# EAGLE schematic DAC breakout (EAGLE 7.4.0)
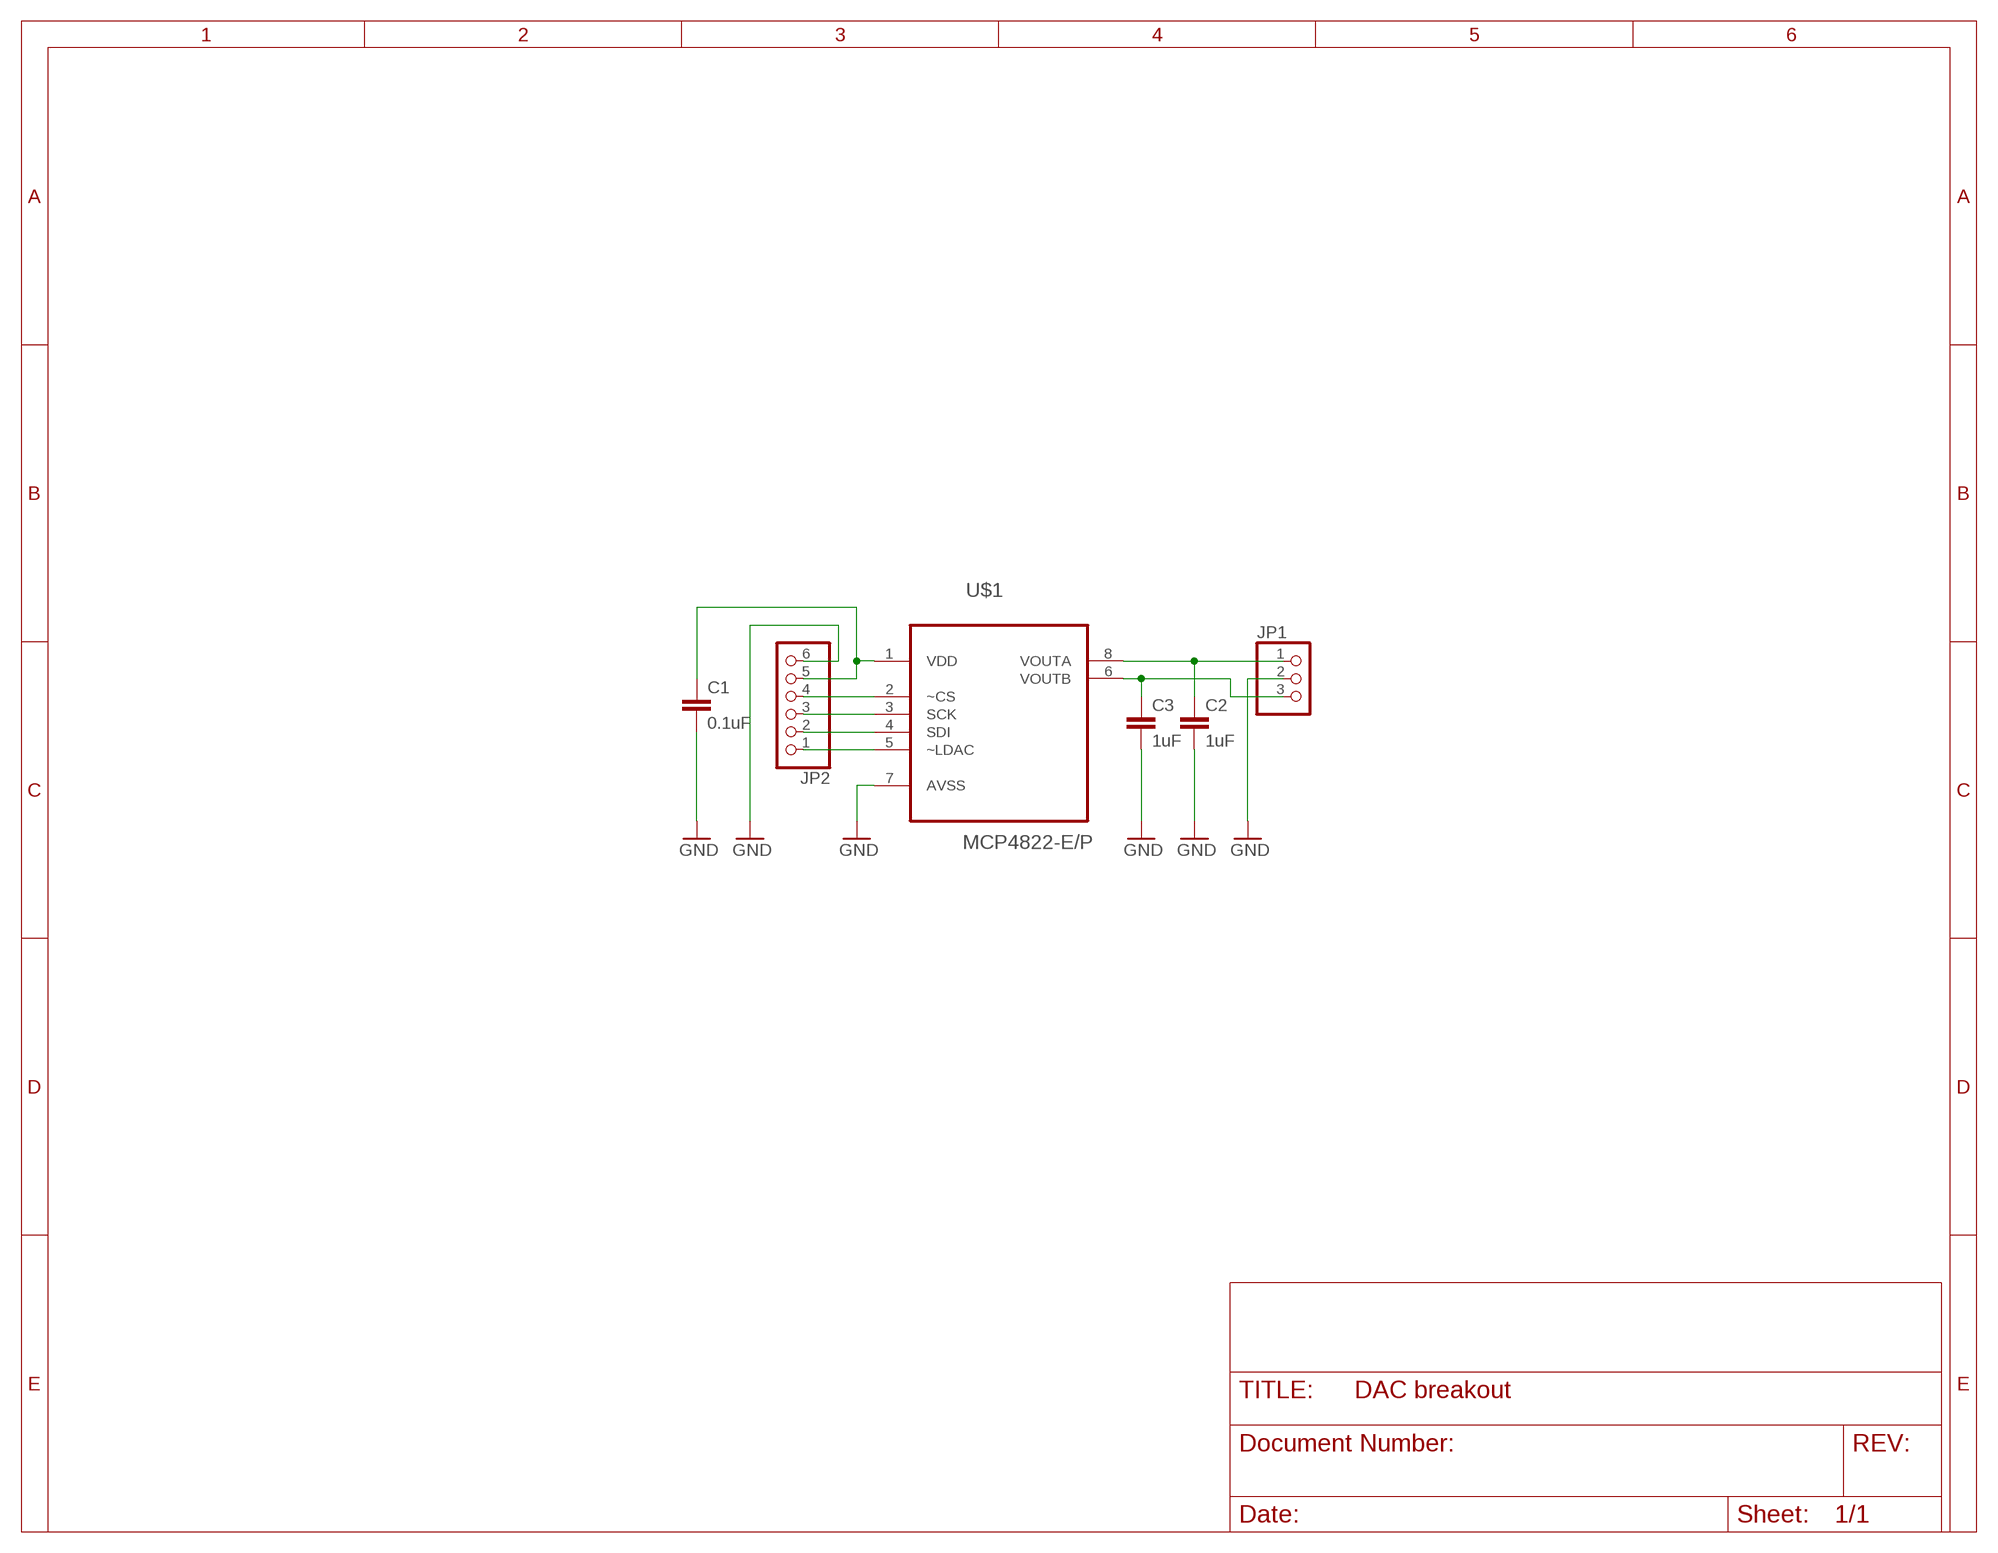
[diagram p0: schematic, sheet 1]

## Parts
C1  0.1uF  C-EU025-025X050  [C025-025X050]
C2  1uF  C-EU025-025X050  [C025-025X050]
C3  1uF  C-EU025-025X050  [C025-025X050]
JP1  PINHD-1X3  [1X03]
JP2  PINHD-1X6  [1X06]
U$1  MCP4822-E/P  [DIP254P762X432-8]

## Nets
GND: C1.2 C2.2 C3.2 JP1.2 JP2.6 U$1.7(AVSS)
N$1: C1.1 JP2.5 U$1.1(VDD)
N$2: C2.1 JP1.1 U$1.8(VOUTA)
N$3: C3.1 JP1.3 U$1.6(VOUTB)
N$4: JP2.4 U$1.2(~CS)
N$5: JP2.3 U$1.3(SCK)
N$6: JP2.2 U$1.4(SDI)
N$7: JP2.1 U$1.5(~LDAC)

## Library data of the parts
C1-C3 = rcl:C-EU: CAPACITOR, European symbol
JP1 = pinhead:PINHD-1X3: PIN HEADER
JP2 = pinhead:PINHD-1X6: PIN HEADER
U$1 = Microchip_By_element14_Batch_1:MCP4822-E/P: DAC; MPN: MCP4822-E/P; OC_FARNELL: 1439413; OC_NEWARK: 11M1705; PACKAGE: DIP-8; SUPPLIER: Microchip